# Altium schematic sheet Esquematico TB66.SchDoc
size A4; SheetNumber: 1; SheetTotal: 1
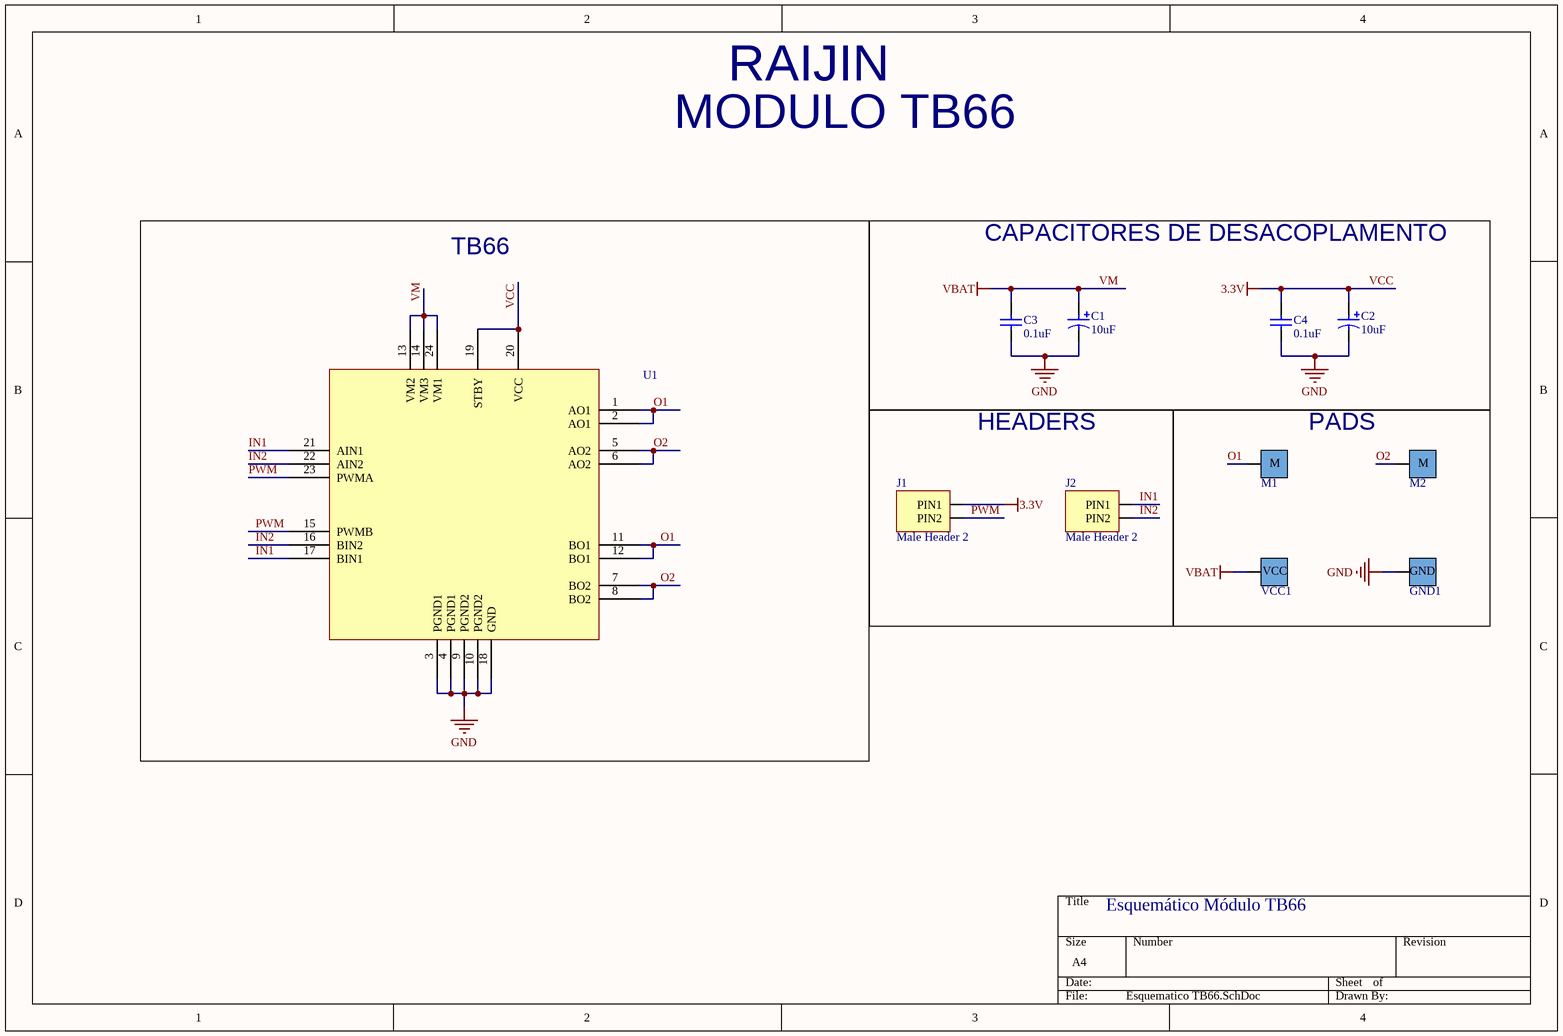
[diagram p0: Esquematico TB66.SchDoc]

## Parts
C1  10uF  [TANTALUM C0805]
C2  10uF  [TANTALUM C0805]
C3  0.1uF  [C0805]
C4  0.1uF  [C0805]
GND1  Ground Pad  (value not drawn)
J1  Male Header 2  [MALE HEADER 2]
J2  Male Header 2  [MALE HEADER 2]
M1  Motor Pad  (value not drawn)
M2  Motor Pad  (value not drawn)
U1  TB6612FNGC8EL  [SSOP-24 (24_pins)]  (value not drawn)
VCC1  Source Pad  (value not drawn)

## Blocks framed on the sheet
TB66: U1
CAPACITORES DE DESACOPLAMENTO: C1-C4
HEADERS: J1 J2
PADS: GND1 M1 M2 VCC1

## Nets
GND: C1.2 C2.2 C3.1 C4.1 GND1.A(GND) U1.3(PGND1) U1.4(PGND1) U1.9(PGND2) U1.10(PGND2) U1.18(GND)
VCC: C2.1 C4.2 J1.PIN1 U1.19(STBY) U1.20(VCC)  [also labelled 3.3V]
VM: C1.1 C3.2 U1.13(VM2) U1.14(VM3) U1.24(VM1) VCC1.A(VCC)  [also labelled VBAT]
IN1: J2.PIN1 U1.17(BIN1) U1.21(AIN1)
IN2: J2.PIN2 U1.16(BIN2) U1.22(AIN2)
O1: M1.M U1.1(AO1) U1.2(AO1) U1.11(BO1) U1.12(BO1)
O2: M2.M U1.5(AO2) U1.6(AO2) U1.7(BO2) U1.8(BO2)
PWM: J1.PIN2 U1.15(PWMB) U1.23(PWMA)

## Notes on the sheet
- RAIJIN
- MODULO TB66
- Esquemático Módulo TB66

## Library data of the parts
C1 C2 = TACR106K016RTA: CAP TAN 10uF 16V 0805; Manufacturer: AVX; Tolerance: 10%; ESR: 5 Ohms using 100kHz; Dieletric: Tantalum; Library Control - Checked Footprint: Yes; Library Control - Person that Checked Footprint: Nikaum; Supplier 1: Mouser; Part Number: TACR106K016RTA; Category: Tantalum Capacitor; Price: 1=2.80, 10=2.26, 100=1.73 (USD); Supplier Part Number 1: 581-TACR106K016RTA; Library Ref: Capacitor; Operating Temperature: -55 C ~ 125 C; Package / Case: 0805 (2012 Metric); Size / Dimension: 2,00 L x 1,35 W x 1,35 H; Value: 10uF; Voltage - Rated: 16V; Library Control - Checked Schematic: Yes; Library Control - Last Update: 27/06/2021 23:38; Library Control - Person that Checked Schematic: Nikaum; Library Control - Person that did the Last Update Footprint: Nikaum; Library Control - Person that did the Last Update Schematic: Nikaum; ComponentLink1Description: Datasheet; ComponentLink1URL: https://br.mouser.com/datasheet/2/40/tac-776418.pdf; ComponentLink2Description: Mouser Link; ComponentLink2URL: https://br.mouser.com/ProductDetail/AVX/TACR106K016RTA?qs=%2Fha2pyFadujLeE4wL2EKCPdndIQ6DHJ9N9WnpswBy3lqS7yORyQ2ug%3D%3D
C3 C4 = 08053C104KAT2A: CAP CER 0.1uF 25V X7R 0805; Manufacturer: AVX; Tolerance: 10%; ESR: 0.05; Library Control - Checked Footprint: Yes; Library Control - Person that Checked Footprint: Nikaum; Supplier 1: Mouser; Part Number: 08053C104KAT2A; Category: Ceramic Capacitor; Price: 1=0,14, 10=0,069, 100=0,038 (USD); Supplier Part Number 1: 581-08053C104K; Library Ref: Capacitor; Operating Temperature: -55 C ~ 125 C; Package / Case: 0805 (2012 metric); Size / Dimension: 2,00 L x 1,20 W x 0,50 H; Value: 0.1uF; Voltage - Rated: 25V; Dieletric: X7R; Library Control - Checked Schematic: Yes; Library Control - Last Update: 27/06/2021 23:35; Library Control - Person that Checked Schematic: Nikaum; Library Control - Person that did the Last Update Footprint: Nikaum; Library Control - Person that did the Last Update Schematic: Nikaum; ComponentLink1Description: Datasheet; ComponentLink1URL: https://br.mouser.com/datasheet/2/40/X7RDielectric-777024.pdf; ComponentLink2Description: Mouser Link; ComponentLink2URL: https://br.mouser.com/ProductDetail/AVX/08053C104KAT2A?qs=EihRZLdKnF2GcTBzDkE%2FiQ%3D%3D
GND1 = Ground Pad Mini Sumô: GND PAD MINI SUMÔ; Cable AWG: 20 / 18 (AWG); Recomended Category: Mini Sumô; Size: 3.5 x 3.5 (mm); Library Ref: Pads
J1 J2 = Male Header 2: Number of Contacts: 2; Library Control - Person that did the Last Update Schematic: Marcos; System: Connector; Library Ref: Header; Library Control - Checked Footprint: *; Library Control - Checked Schematic: *; Library Control - Last Project that Used: *; Library Control - Last Update: *; Library Control - Person that Checked Footprint: *; Library Control - Person that Checked Schematic: *; Library Control - Persont that did the Last Update Footprint: Marcos
M1 M2 = Motor Pad Mini Sumô: Cable AWG: 20 / 18 (AWG); Recomended Category: Mini Sumô; Size: 3.5 x 3.5 (mm); Library Ref: Pads
U1 = TB6612FNGC8EL: IC MTR DRV (2.5V ~ 13.5V) (1A)  SSOP-24; Manufacturer: Toshiba; Suplier Part Number 1: 757-TB6612FNGC8EL; Operating Supply Current: 1.2A; Current - Peak Output (Source, Sink): 3.2A / 3.2A; Voltage - Supply: 2.7V ~ 5.5V; Power Dissipation: 1.36W; Rise / Fall Time (Typ): 24ns / 41ns; Output Configuration: Half Bridge (4); Logic Voltage - VIL, VIH: VIL = (-0.2 V ~ VCCx0.3 V) / VIH = (VCCx0.7 V ~ VCC+0.2 V); Library Control - Checked Schematic: Yes; Library Control - Person that Checked Schematic: Stéfany (Ster); Logic (IN-SD/High Low): IN-SD; Category: Driver; Supplier 1: Mouser; Part Number: TB6612FNGC8EL; Price: 1=2,04000, 10=1,73000, 100=1,35000 (USD); Technology: Power MOSFET; Package / Case: SSOP-24; Current - Output: 1A; Voltage - Load: 2.5V ~ 13.5V; Operating Temperature: -20°C ~ 85°C; Library Ref: Driver; Library Control - Checked Footprint: Yes; Library Control - Last Update: 12/06/2021 13:08; Library Control - Person that Checked Footprint: Stéfany (Ster); Library Control - Person that did the Last Update Schematic: Stéfany (Ster); Library Control - Person that did the Last Update Footprint: Stéfany (Ster); ComponentLink1Description: Mouser Link / ST Link; ComponentLink1URL: https://br.mouser.com/ProductDetail/Toshiba/TB6612FNGC8EL?qs=%2Fha2pyFaduieefomnoxxebedNwY2WKSkzrp98JlLlMnHs8uJoj3o8Gf3S6kFGc6f; ComponentLink2Description: Datasheet; ComponentLink2URL: https://br.mouser.com/datasheet/2/408/TB6612FNG_datasheet_en_20141001-708260.pdf
VCC1 = Source Pad Mini Sumô: VCC PAD MINI SUMÔ; Cable AWG: 20 / 18 (AWG); Recomended Category: Mini Sumô; Size: 3.5 x 3.5 (mm); Library Ref: Pads